# Altium schematic sheet SCH3_Fan_Control.SchDoc: Airsoft FAN Controller
size A4
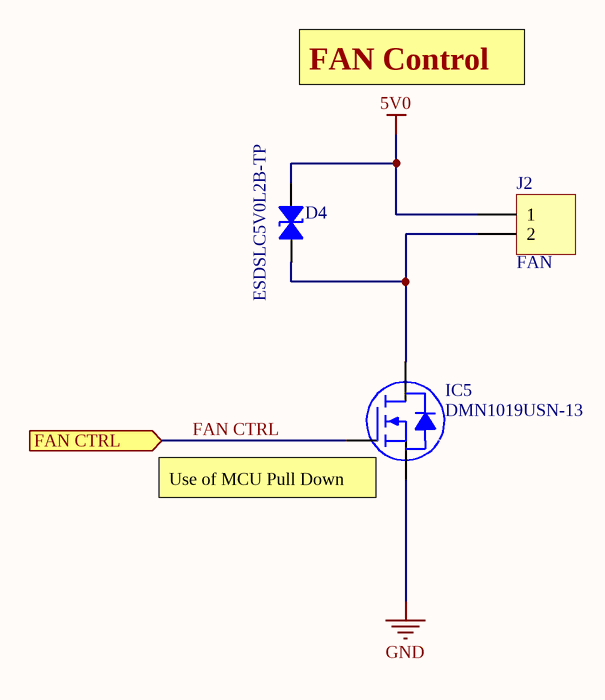
[diagram p0: SCH3_Fan_Control.SchDoc]

## Parts
D4  ESDSLC5V0L2B-TP  [0402]
IC5  DMN1019USN-13  [DIODES SOT-23-3]
J2  FAN  [FAN Connections]

## Ports
FAN CTRL (in)

## Nets
5V0: D4.2 J2.1
GND: IC5.2(S)
FAN CTRL: IC5.1(G) ; port FAN CTRL
NetD4_1: D4.1 IC5.3(D) J2.2

## Notes on the sheet
- FAN Control
- (near IC5) Use of MCU Pull Down
- Title
- Size:
- Date:
- A4
- Number:
- Time:
- Revision:
- Sheet
- of
- File:

## Library data of the parts
D4 = ESDSLC5V0L2B-TP: 5.5V, ESD PROTECTION DEVICES, DF; Manufacturer: Micro Commercial Co; Bidirectional Channels: 1; Capacitance @ Frequency: 0.15pF @ 1MHz; Current - Peak Pulse (10/1000µs): 3A (8/20µs); Power Line Protection: No; Power - Peak Pulse: 40W; Type: Zener; Voltage - Breakdown (Min): 6.5V; Voltage - Clamping (Max) @ Ipp: 15V; Voltage - Reverse Standoff (Typ): 5.5V (Max); Part Number: ESDSLC5V0L2B-TP; Applications: General Purpose; ComponentLink1Description: Datasheet; ComponentLink1URL: https://mccsemi.com/pdf/Products/ESDSLC5V0L2B(DFN1006-2L)-V1.pdf; ComponentLink2Description: DigiKey Link; ComponentLink2URL: http://digikey.com/product-detail/en/micro-commercial-co/ESDSLC5V0L2B-TP/353-ESDSLC5V0L2B-TPCT-ND/12177299; LastUpdated: 8/30/2020 9:08:11 PM; Lifecycle Status: Active; Minimum Order: 1; Mounting Type: Surface Mount; Operating Temperature: -55°C ~ 150°C (TJ); Package / Case: 0402 (1006 Metric); Packaging: Unknown; PartId: 11464; Price: 0.03; Supplier 1: DigiKey; Supplier Part Number 1: 353-ESDSLC5V0L2B-TPCT-ND; Supplier Device Package: DFN1006-2L
IC5 = DMN1019USN-13: MOSFET N-CH 12V 9.3A SC59; Manufacturer: Diodes Incorporated; Current - Continuous Drain (Id) @ 25°C: 9.3A (Ta); Drive Voltage (Max Rds On,  Min Rds On): 1.2V, 2.5V; FET Type: N-Channel; Gate Charge (Qg) (Max) @ Vgs: 50.6nC @ 8V; Input Capacitance (Ciss) (Max) @ Vds: 2426pF @ 10V; Power Dissipation (Max): 680mW (Ta); Rds On (Max) @ Id, Vgs: 10mOhm @ 9.7A, 4.5V; Vgs (Max): ±8V; Vgs(th) (Max) @ Id: 800mV @ 250µA; Part Number: DMN1019USN-13; ComponentLink1Description: Datasheet; ComponentLink1URL: https://www.diodes.com/assets/Datasheets/DMN1019USN.pdf; ComponentLink2Description: DigiKey Link; ComponentLink2URL: http://digikey.com/product-detail/en/diodes-incorporated/DMN1019USN-13/DMN1019USN-13DICT-ND/4898885; Drain to Source Voltage (Vdss): 12V; LastUpdated: 9/2/2020 1:25:02 AM; Lifecycle Status: Active; Minimum Order: 1; Mounting Type: Surface Mount; Operating Temperature: -55°C ~ 150°C (TJ); Package / Case: TO-236-3, SC-59, SOT-23-3; Packaging: TapeAndReel; Part Status: Active; Price: 0.10; Series: -; Supplier 1: DigiKey; Supplier Part Number 1: DMN1019USN-13DICT-ND; Supplier Device Package: SC-59; Technology: MOSFET (Metal Oxide)
J2 = FAN Connection: Fan Connection Test Points; LatestRevisionDate: 17-Jul-2002; LatestRevisionNote: Re-released for DXP Platform.; Publisher: Altium Limited